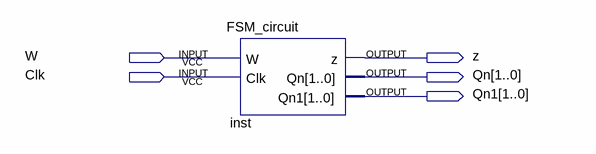
[diagram p0: schematic sheet]
// Quartus schematic L0901.bdf as structural Verilog: 1 symbols, 5 pins
module L0901 (
  input  W,
  input  Clk,
  output z,
  output [1:0] Qn,
  output [1:0] Qn1
);

  FSM_circuit inst (.W(W), .Clk(Clk), .z(z), .Qn(Qn), .Qn1(Qn1));
endmodule
